# EAGLE schematic matrix_led_shield_schematic (EAGLE 9.2.2)
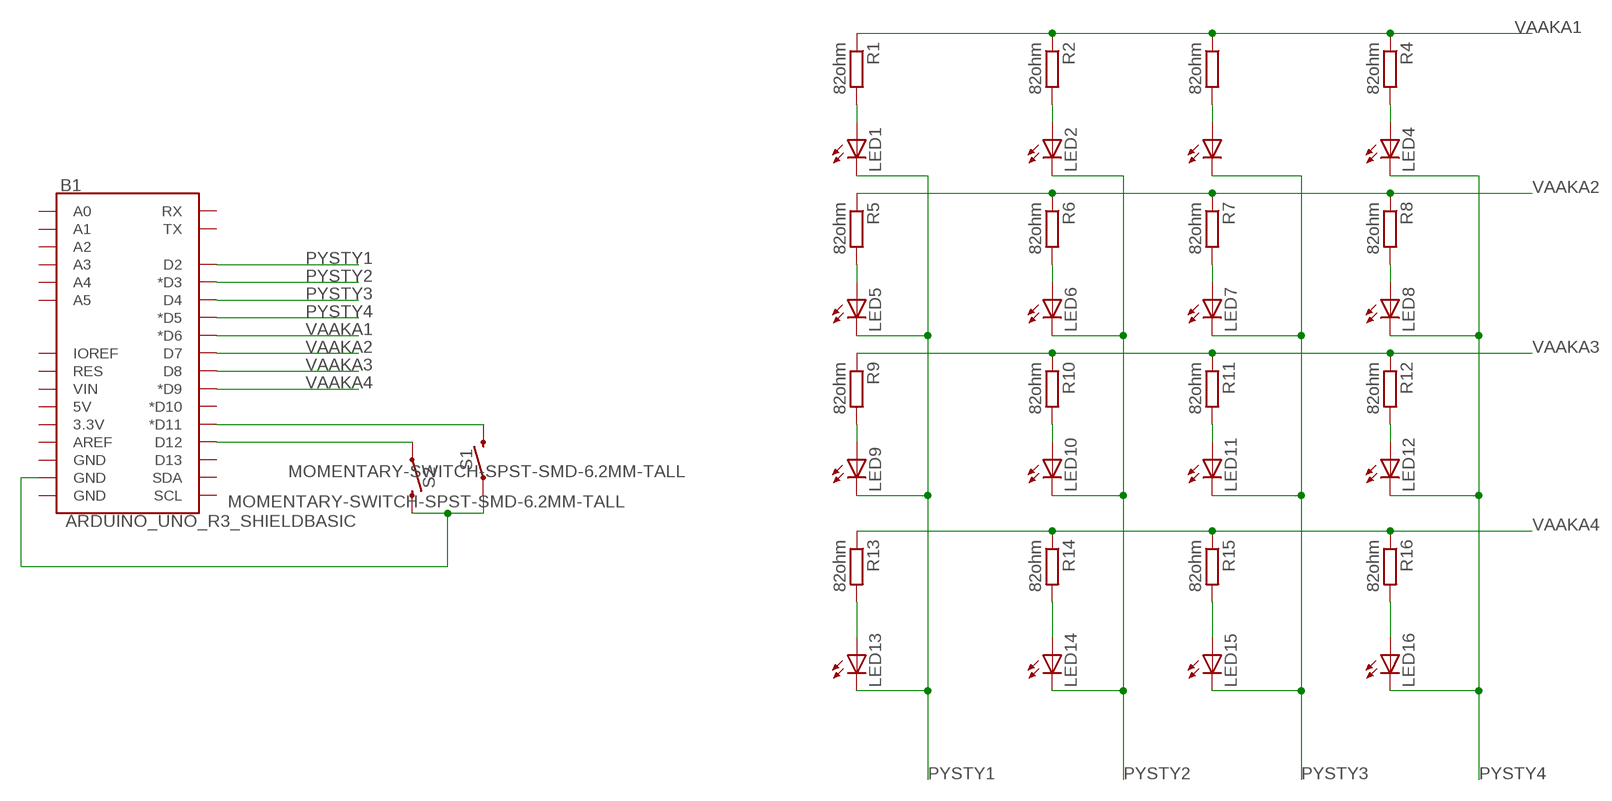
[diagram p0: schematic, sheet 1]

## Parts
B1  ARDUINO_UNO_R3_SHIELDBASIC  [UNO_R3_SHIELD]
LED1  LG_T679-E1F1-1  [PLCC2]
LED2  LG_T679-E1F1-1  [PLCC2]
LED3  LG_T679-E1F1-1  [PLCC2]
LED4  LG_T679-E1F1-1  [PLCC2]
LED5  LG_T679-E1F1-1  [PLCC2]
LED6  LG_T679-E1F1-1  [PLCC2]
LED7  LG_T679-E1F1-1  [PLCC2]
LED8  LG_T679-E1F1-1  [PLCC2]
LED9  LG_T679-E1F1-1  [PLCC2]
LED10  LG_T679-E1F1-1  [PLCC2]
LED11  LG_T679-E1F1-1  [PLCC2]
LED12  LG_T679-E1F1-1  [PLCC2]
LED13  LG_T679-E1F1-1  [PLCC2]
LED14  LG_T679-E1F1-1  [PLCC2]
LED15  LG_T679-E1F1-1  [PLCC2]
LED16  LG_T679-E1F1-1  [PLCC2]
R1  82ohm  R-EU_M0805  [M0805]
R2  82ohm  R-EU_M0805  [M0805]
R3  82ohm  R-EU_M0805  [M0805]
R4  82ohm  R-EU_M0805  [M0805]
R5  82ohm  R-EU_M0805  [M0805]
R6  82ohm  R-EU_M0805  [M0805]
R7  82ohm  R-EU_M0805  [M0805]
R8  82ohm  R-EU_M0805  [M0805]
R9  82ohm  R-EU_M0805  [M0805]
R10  82ohm  R-EU_M0805  [M0805]
R11  82ohm  R-EU_M0805  [M0805]
R12  82ohm  R-EU_M0805  [M0805]
R13  82ohm  R-EU_M0805  [M0805]
R14  82ohm  R-EU_M0805  [M0805]
R15  82ohm  R-EU_M0805  [M0805]
R16  82ohm  R-EU_M0805  [M0805]
S1  MOMENTARY-SWITCH-SPST-SMD-6.2MM-TALL  [TACTILE_SWITCH_SMD_6.2MM_TALL]
S2  MOMENTARY-SWITCH-SPST-SMD-6.2MM-TALL  [TACTILE_SWITCH_SMD_6.2MM_TALL]

## Nets
N$1: B1.D12 S2.A2
N$2: B1.D11(*D11) S1.B2
N$3: B1.GND@1(GND) S1.A2 S2.B2
N$4: LED1.A R1.2
N$5: LED2.A R2.2
N$6: LED3.A R3.2
N$7: LED4.A R4.2
N$8: LED5.A R5.2
N$9: LED6.A R6.2
N$10: LED7.A R7.2
N$11: LED8.A R8.2
N$12: LED9.A R9.2
N$13: LED10.A R10.2
N$14: LED11.A R11.2
N$15: LED12.A R12.2
N$16: LED13.A R13.2
N$17: LED14.A R14.2
N$18: LED15.A R15.2
N$19: LED16.A R16.2
PYSTY1: B1.D2 LED1.C LED5.C LED9.C LED13.C
PYSTY2: B1.D3(*D3) LED2.C LED6.C LED10.C LED14.C
PYSTY3: B1.D4 LED3.C LED7.C LED11.C LED15.C
PYSTY4: B1.D5(*D5) LED4.C LED8.C LED12.C LED16.C
VAAKA1: B1.D6(*D6) R1.1 R2.1 R3.1 R4.1
VAAKA2: B1.D7 R5.1 R6.1 R7.1 R8.1
VAAKA3: B1.D8 R9.1 R10.1 R11.1 R12.1
VAAKA4: B1.D9(*D9) R13.1 R14.1 R15.1 R16.1
Unconnected: B1.3.3V B1.5V B1.A0 B1.A1 B1.A2 B1.A3 B1.A4 B1.A5 B1.AREF B1.D10(*D10) B1.D13 B1.GND@0(GND) B1.GND@2(GND) B1.IOREF B1.RES B1.RX B1.SCL B1.SDA B1.TX B1.VIN

## Library data of the parts
B1 = SparkFun-Boards:ARDUINO_UNO_R3_SHIELD: Arduino R3 Shield Footprint Shield form compatible with the Arduino Uno R3. SparkFun Products: MG2639 Cellular Shield <https://www.sparkfun.com/products/13120> MIDI Shield <https://www.sparkfun.com/products/12898> R3 Stackable Headers Kit <https://www.sparkfun.com/products/11417>
LED1-LED16 = led:*_T679-?-1: LC TOPLED® Low Current LED Source: http://catalog.osram-os.com .. LG_LS_LY_T679_OBS.pdf; COLOR: green
R1-R16 = rcl:R-EU_: RESISTOR, European symbol; SPICEPREFIX: R
S1 S2 = SparkFun-Switches:MOMENTARY-SWITCH-SPST: Momentary Switch (Pushbutton) - SPST Normally-open (NO) SPST momentary switches (buttons, pushbuttons). Variants PTH-12MM - 12mm square, through-hole Momentary Pushbutton Switch - 12mm Square <https://www.sparkfun.com/products/9190> (COM-09190) PTH-6.0MM, PTH-6.0MM-KIT - 6.0mm square, through-hole Mini Pushbutton Switch <https://www.sparkfun.com/products/97> (COM-00097) KIT package intended for soldering kit's - only one side of pads' copper is exposed. PTH-RIGHT-ANGLE-KIT - Right-angle, through-hole Right Angle Tactile Button <https://www.sparkfun.com/products/10791> - Used on SparkFun BigTime Watch Kit <https://www.sparkfun.com/products/11734> SMD-12MM - 12mm square, surface-mount Tactile Button - SMD (12mm) <https://www.sparkfun.com/products/12993> (COM-12993) Used on SparkFun PicoBoard <https://www.sparkfun.com/products/11888> SMD-4.5MM - 4.5mm Square Trackball Switch Used on SparkFun Blackberry Trackballer Breakout <https://www.sparkfun.com/products/13169> SMD-4.6MMX2.8MM - 4.60mm x 2.80mm, surface mount Used on SparkFun SAMD21 Mini Breakout <https://www.sparkfun.com/products/13664> SMD-5.2MM, SMD-5.2-REDUNDANT - 5.2mm square, surface-mount Mini Pushbutton Switch - SMD <https://www.sparkfun.com/products/8720> (COM-08720) Used on Arduino Pro Mini <https://www.sparkfun.com/products/11114> REDUNDANT package connects both switch circuits together SMD-6.0X3.5MM - 6.0 x 3.5mm, surface mount Momentary Reset Switch SMD <https://www.sparkfun.com/products/8229> (COM-08229) SMD-6.2MM-TALL - 6.2mm square, surface mount Tactile Button - SMD (6mm) <https://www.sparkfun.com/products/12992> Used on SparkFun Digital Sandbox <https://www.sparkfun.com/products/12651> SMD-RIGHT-ANGLE - Right-angle, surface mount Used on SparkFun Block for Intel® Edison - Arduino <https://www.sparkfun.com/products/13036>; PROD_ID: SWCH-11966; SF_SKU: COM-12992

## Net classes
0 default: width 0.762 mm, clearance 0.254 mm